# EAGLE schematic Node (EAGLE 7.3.0)
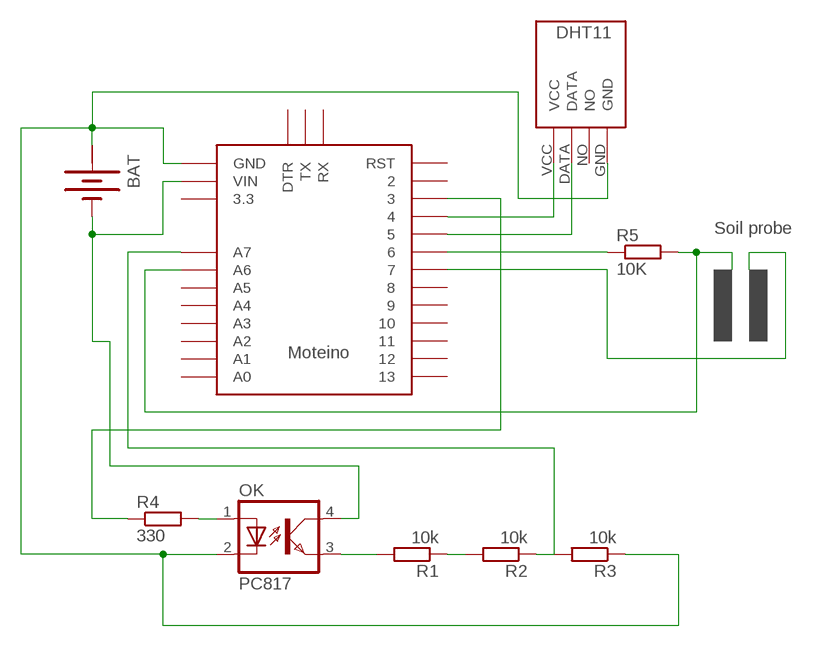
[diagram p0: schematic, sheet 1]

## Parts
BAT  BATTERY  [BATTERY]
MOTEINO  MOTEINO-R3  [MOTEINO_R3]
OK  PC817  [DIL04]
R1  10k  R-EU_RDH/15  [RDH/15]
R2  10k  R-EU_RDH/15  [RDH/15]
R3  10k  R-EU_RDH/15  [RDH/15]
R4  330  R-EU_RDH/15  [RDH/15]
R5  10K  R-EU_RDH/15  [RDH/15]
U$1  DHT11  [DHT11]

## Nets
N$2: R2.1 R3.2
N$3: MOTEINO.A7
N$4: R1.1 R2.2
N$5: BAT.- MOTEINO.VIN MOTEINO.VIN1(VIN) OK.4(COL)
N$6: OK.3(EMIT) R1.2
N$7: BAT.+ MOTEINO.GND MOTEINO.GND1(GND) OK.2(C) R3.1 U$1.GND
N$9: MOTEINO.4 U$1.VCC
N$10: MOTEINO.5 U$1.DATA
N$11: OK.1(A) R4.2
N$12: MOTEINO.3 R4.1
N$13: MOTEINO.6 R5.1
N$14: MOTEINO.A6 R5.2
N$15: MOTEINO.7
Unconnected: MOTEINO.2 MOTEINO.3.3 MOTEINO.8 MOTEINO.9 MOTEINO.10 MOTEINO.11 MOTEINO.12 MOTEINO.13 MOTEINO.A0 MOTEINO.A1 MOTEINO.A2 MOTEINO.A3 MOTEINO.A4 MOTEINO.A5 MOTEINO.DTR MOTEINO.RST MOTEINO.RX MOTEINO.RX2(RX) MOTEINO.TX MOTEINO.TX2(TX) U$1.NO

## Notes on the sheet
- Soil probe
- Moteino

## Power pins joined to a net without a drawn wire
+: BAT.+@1(+)

## Library data of the parts
BAT = special:BATTERY: BATTERY
MOTEINO = Moteino:MOTEINO-R3
OK = optocoupler:PC817: SHARP OPTO COUPLER; MPN: PC817X4J000F; OC_FARNELL: 9707727; OC_NEWARK: 97K7059
R1-R5 = resistor:R-EU_: RESISTOR, European symbol
U$1 = DHT11:DHT11: DHT11 Czujnik temperatury i wilgotności